# EAGLE design pc_rpi_healthypi_v3 (EAGLE 6.6.0)

## Sheet 1 of 2
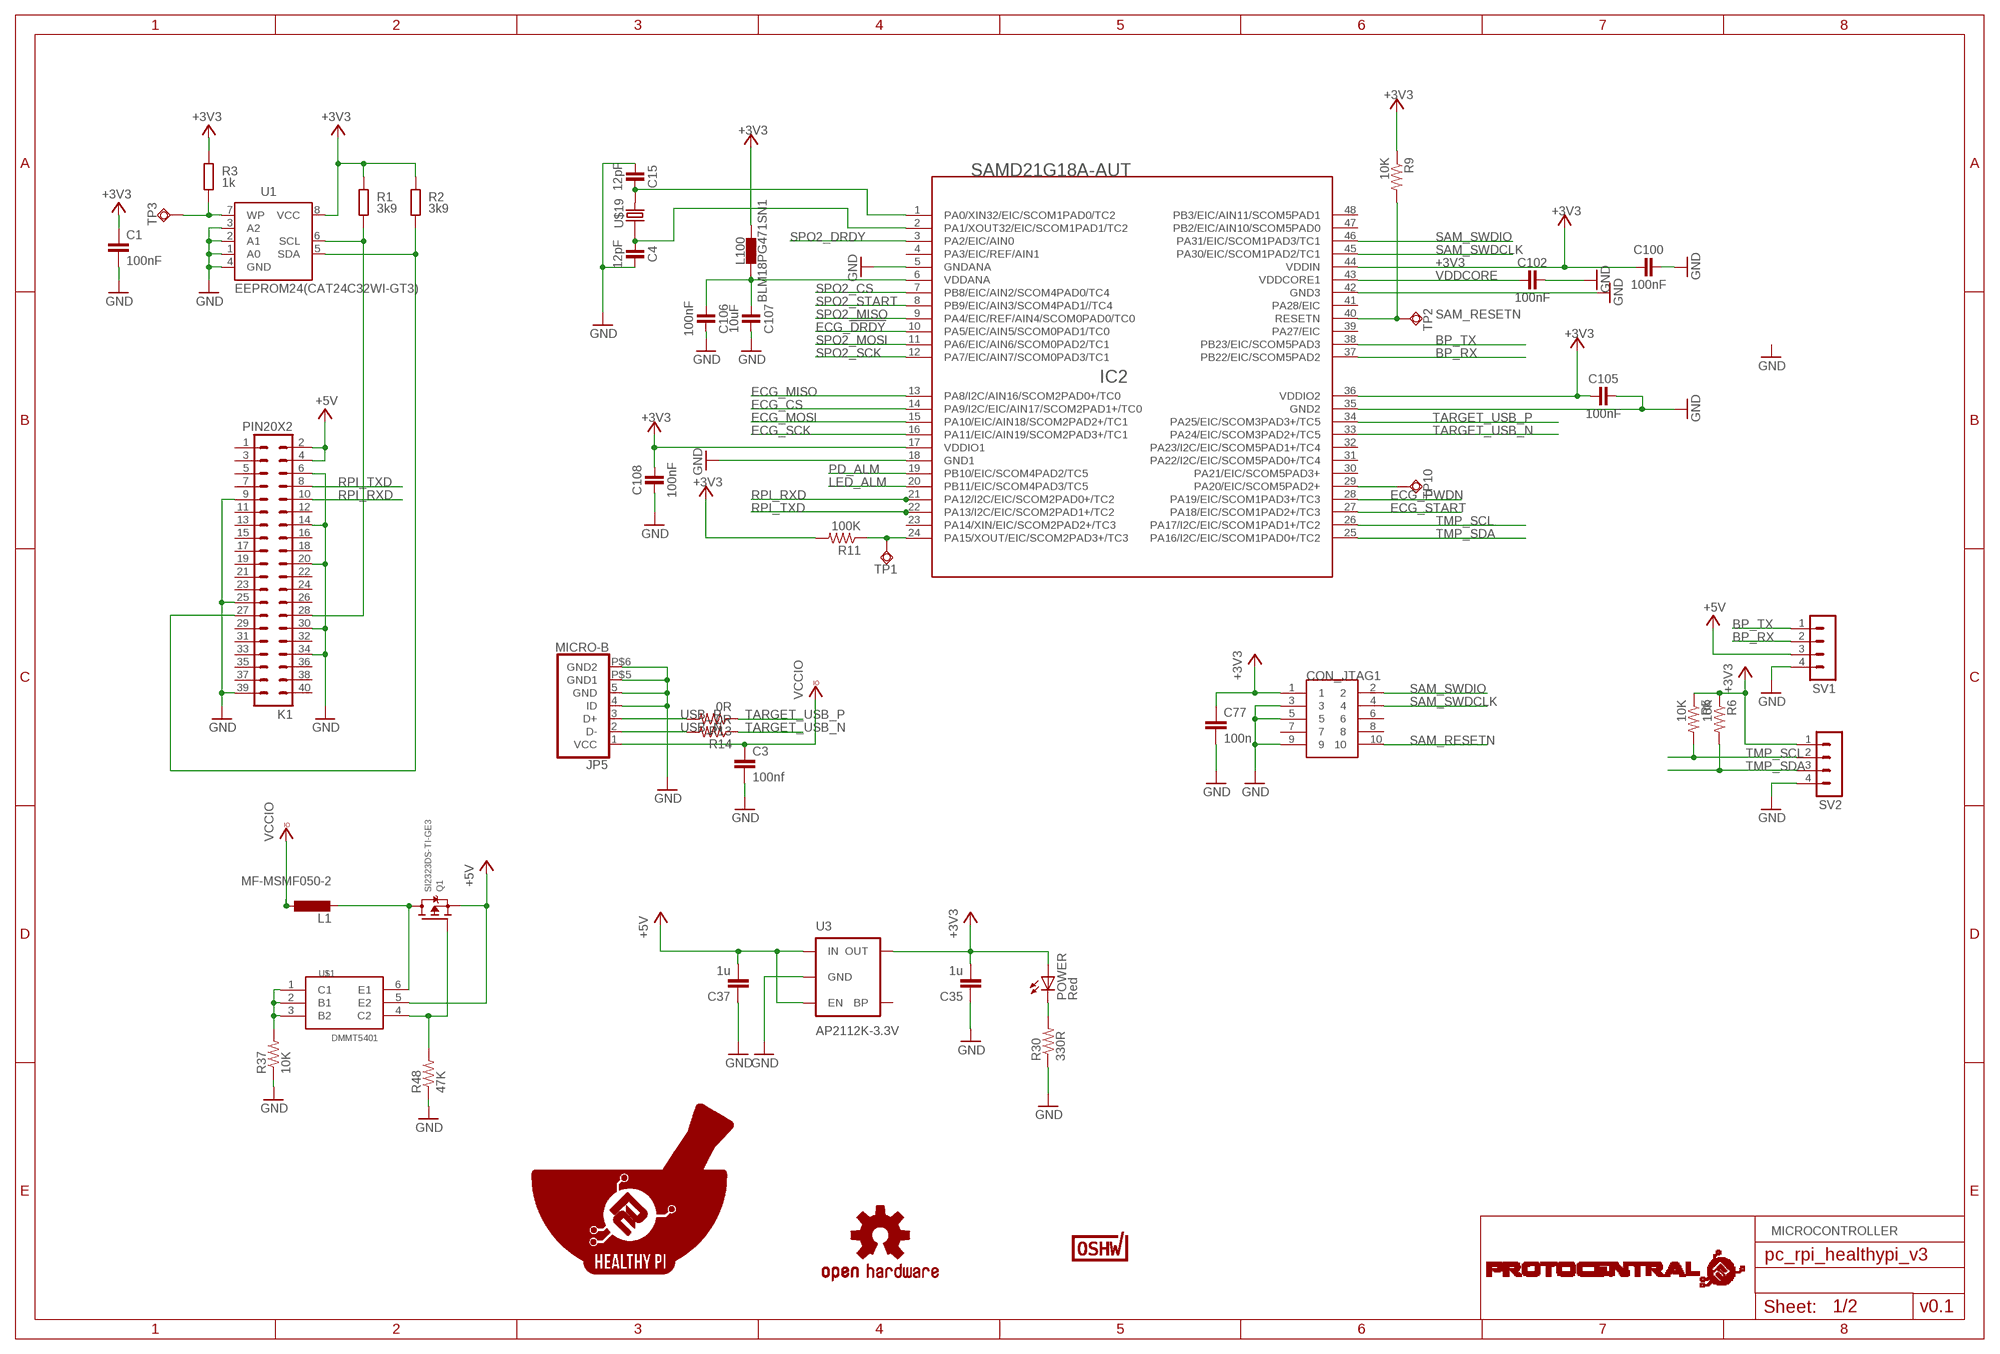
[diagram p0: schematic, sheet 1]

### Parts
C1  100nF  C-EUC0805K  [C0805K]
C3  100nf  C-EUC0402  [C0402]
C4  12pF  CAPACITORS-0402  [C0402]
C15  12pF  CAPACITORS-0402  [C0402]
C35  1u  C-EUC0402  [C0402]
C37  1u  C-EUC0402  [C0402]
C77  100n  C-EUC0805  [C0805]
C100  100nF  CAPACITORS-0805  [C0805]
C102  100nF  CAPACITORS-0805  [C0805]
C105  100nF  CAPACITORS-0805  [C0805]
C106  100nF  CAPACITORS-0805  [C0805]
C107  10uF  CAPACITORS-0805  [C0805]
C108  100nF  CAPACITORS-0805  [C0805]
CON_JTAG1  HDR-SMT-50MIL/5X2(20021121-00010C4LF)  HDR-SMT-50MIL/5X2  [HDR-SMT-50MIL/5X2]
IC2  SAMD21G18A-AUT  SAMD21G18A  [TQFP48]
JP5  MICRO-B  [MICRO-B]
K1  PIN20X2  [PIN_20X2]
L1  MF-MSMF050-2  L-EUL1812  [L1812]
L100  BLM18PG471SN1  INDUCTOR-0603  [C0603]
POWER  Red  LEDCHIPLED_0603  [CHIPLED_0603]
Q1  SI2323DS-TI-GE3  MOSFET-P  [SOT23-R]
R1  3k9  R-EU_M0805  [M0805]
R2  3k9  R-EU_M0805  [M0805]
R3  1k  R-EU_M0805  [M0805]
R5  10K  R-US_R0402  [R0402]
R6  10K  R-US_R0402  [R0402]
R9  10K  R-US_R0805  [R0805]
R11  100K  R-US_R0805  [R0805]
R13  0R  R-US_R0402  [R0402]
R14  0R  R-US_R0402  [R0402]
R30  330R  R-US_R0402  [R0402]
R37  10K  R-US_R0805  [R0805]
R48  47K  R-US_R0805  [R0805]
SV1  MA04-1  [MA04-1]
SV2  MA04-1  [MA04-1]
TP1  TPSQB1,27  [B1,27]
TP2  TPSQB1,27  [B1,27]
TP3  TPSQB1,27  [B1,27]
TP10  TPSQB1,27  [B1,27]
U1  EEPROM24(CAT24C32WI-GT3)  EEPROM24  [SOIC8]
U3  AP2112K-3.3V  V_REG_LDOSMD  [SOT23-5]
U$1  DMMT5401  [SOT26]
U$5  OSHW-LOGOM  [OSHW-LOGO-M]
U$6  PROTY_LOGO_WITH_TEXT  [PROTY_WITH_TEXT]
U$13  CERT-SMALL  [CERT-SMALL-SILK]
U$15  HEALTHYPI  [HEALTHYPI]
U$19  520-327-12.5-34B(32.768KHZ)  ECS-X-34B  [ECX-31B]

### Nets
+3V3: C1.1 C35.2 C77.1 C100.1 C105.1 C108.2 CON_JTAG1.1 IC2.17(VDDIO1) IC2.36(VDDIO2) IC2.44(VDDIN) L100.2 POWER.A R1.2 R2.2 R3.2 R5.1 R6.1 R9.1 R11.2 SV2.1 U1.8(VCC) U3.5(OUT) ; also sheet 2
+5V: C37.2 K1.2 K1.4 Q1.2(S) SV1.3 U3.1(IN) U3.3(EN) U$1.5(E2)
BP_RX: IC2.37(PB22/EIC/SCOM5PAD2) SV1.2
BP_TX: IC2.38(PB23/EIC/SCOM5PAD3) SV1.1
ECG_!DRDY: IC2.10(PA5/EIC/AIN5/SCOM0PAD1/TC0) ; also sheet 2
ECG_CS: IC2.14(PA9/I2C/EIC/AIN17/SCOM2PAD1+/TC0) ; also sheet 2
ECG_MISO: IC2.13(PA8/I2C/AIN16/SCOM2PAD0+/TC0) ; also sheet 2
ECG_MOSI: IC2.15(PA10/EIC/AIN18/SCOM2PAD2+/TC1) ; also sheet 2
ECG_PWDN: IC2.28(PA19/EIC/SCOM1PAD3+/TC3) ; also sheet 2
ECG_SCK: IC2.16(PA11/EIC/AIN19/SCOM2PAD3+/TC1) ; also sheet 2
ECG_START: IC2.27(PA18/EIC/SCOM1PAD2+/TC3) ; also sheet 2
GND: C1.2 C3.2 C4.2 C15.1 C35.1 C37.1 C77.2 C100.2 C102.2 C105.2 C106.2 C107.2 C108.1 CON_JTAG1.3 CON_JTAG1.5 CON_JTAG1.9 IC2.5(GNDANA) IC2.18(GND1) IC2.35(GND2) IC2.42(GND3) JP5.4(ID) JP5.5(GND) JP5.P$5(GND1) JP5.P$6(GND2) K1.6 K1.9 K1.14 K1.20 K1.25 K1.30 K1.34 K1.39 R30.1 R37.1 R48.1 SV1.4 SV2.4 U1.1(A0) U1.2(A1) U1.3(A2) U1.4(GND) U3.2(GND) ; also sheet 2
LED_ALM: IC2.20(PB11/EIC/SCOM4PAD3/TC5) ; also sheet 2
N$1: K1.28 R1.1 U1.6(SCL)
N$2: K1.27 R2.1 U1.5(SDA)
N$3: R3.1 TP3.TP U1.7(WP)
N$4: C15.2 IC2.1(PA0/XIN32/EIC/SCOM1PAD0/TC2) U$19.P$2
N$6: C106.1 C107.1 IC2.6(VDDANA) L100.1
N$7: POWER.C R30.2
N$25: C4.1 IC2.2(PA1/XOUT32/EIC/SCOM1PAD1/TC2) U$19.P$1
N$57: IC2.24(PA15/XOUT/EIC/SCOM2PAD3+/TC3) R11.1 TP1.TP
N$69: IC2.29(PA20/EIC/SCOM5PAD2+) TP10.TP
N$72: R37.2 U$1.1(C1) U$1.2(B1) U$1.3(B2)
N$73: Q1.1(G) R48.2 U$1.4(C2)
N$80: L1.2 Q1.3(D) U$1.6(E1)
PD_ALM: IC2.19(PB10/EIC/SCOM4PAD2/TC5) ; also sheet 2
RPI_RXD: IC2.21(PA12/I2C/EIC/SCOM2PAD0+/TC2) K1.10
RPI_TXD: IC2.22(PA13/I2C/EIC/SCOM2PAD1+/TC2) K1.8
SAM_RESETN: CON_JTAG1.10 IC2.40(RESETN) R9.2 TP2.TP
SAM_SWDCLK: CON_JTAG1.4 IC2.45(PA30/EIC/SCOM1PAD2/TC1)
SAM_SWDIO: CON_JTAG1.2 IC2.46(PA31/EIC/SCOM1PAD3/TC1)
SPO2_CS: IC2.7(PB8/EIC/AIN2/SCOM4PAD0/TC4) ; also sheet 2
SPO2_DRDY: IC2.3(PA2/EIC/AIN0) ; also sheet 2
SPO2_MISO: IC2.9(PA4/EIC/REF/AIN4/SCOM0PAD0/TC0) ; also sheet 2
SPO2_MOSI: IC2.11(PA6/EIC/AIN6/SCOM0PAD2/TC1) ; also sheet 2
SPO2_SCK: IC2.12(PA7/EIC/AIN7/SCOM0PAD3/TC1) ; also sheet 2
SPO2_START: IC2.8(PB9/EIC/AIN3/SCOM4PAD1//TC4) ; also sheet 2
TARGET_USB_N [USBpair]: IC2.33(PA24/EIC/SCOM3PAD2+/TC5) R14.1
TARGET_USB_P [USBpair]: IC2.34(PA25/EIC/SCOM3PAD3+/TC5) R13.1
TMP_SCL: IC2.26(PA17/I2C/EIC/SCOM1PAD1+/TC2) R5.2 SV2.2
TMP_SDA: IC2.25(PA16/I2C/EIC/SCOM1PAD0+/TC2) R6.2 SV2.3
USB_N [USBpair]: JP5.2(D-) R14.2
USB_P [USBpair]: JP5.3(D+) R13.2
VCCIO: C3.1 JP5.1(VCC) L1.1
VDDCORE: C102.1 IC2.43(VDDCORE1)
Unconnected: CON_JTAG1.6 CON_JTAG1.7 CON_JTAG1.8 IC2.4(PA3/EIC/REF/AIN1) IC2.23(PA14/XIN/EIC/SCOM2PAD2+/TC3) IC2.30(PA21/EIC/SCOM5PAD3+) IC2.31(PA22/I2C/EIC/SCOM5PAD0+/TC4) IC2.32(PA23/I2C/EIC/SCOM5PAD1+/TC4) IC2.39(PA27/EIC) IC2.41(PA28/EIC) IC2.47(PB2/EIC/AIN10/SCOM5PAD0) IC2.48(PB3/EIC/AIN11/SCOM5PAD1) K1.1 K1.3 K1.5 K1.7 K1.11 K1.12 K1.13 K1.15 K1.16 K1.17 K1.18 K1.19 K1.21 K1.22 K1.23 K1.24 K1.26 K1.29 K1.31 K1.32 K1.33 K1.35 K1.36 K1.37 K1.38 K1.40 U3.4(BP)

### Notes on the sheet
- MICROCONTROLLER
- v0.1

## Sheet 2 of 2
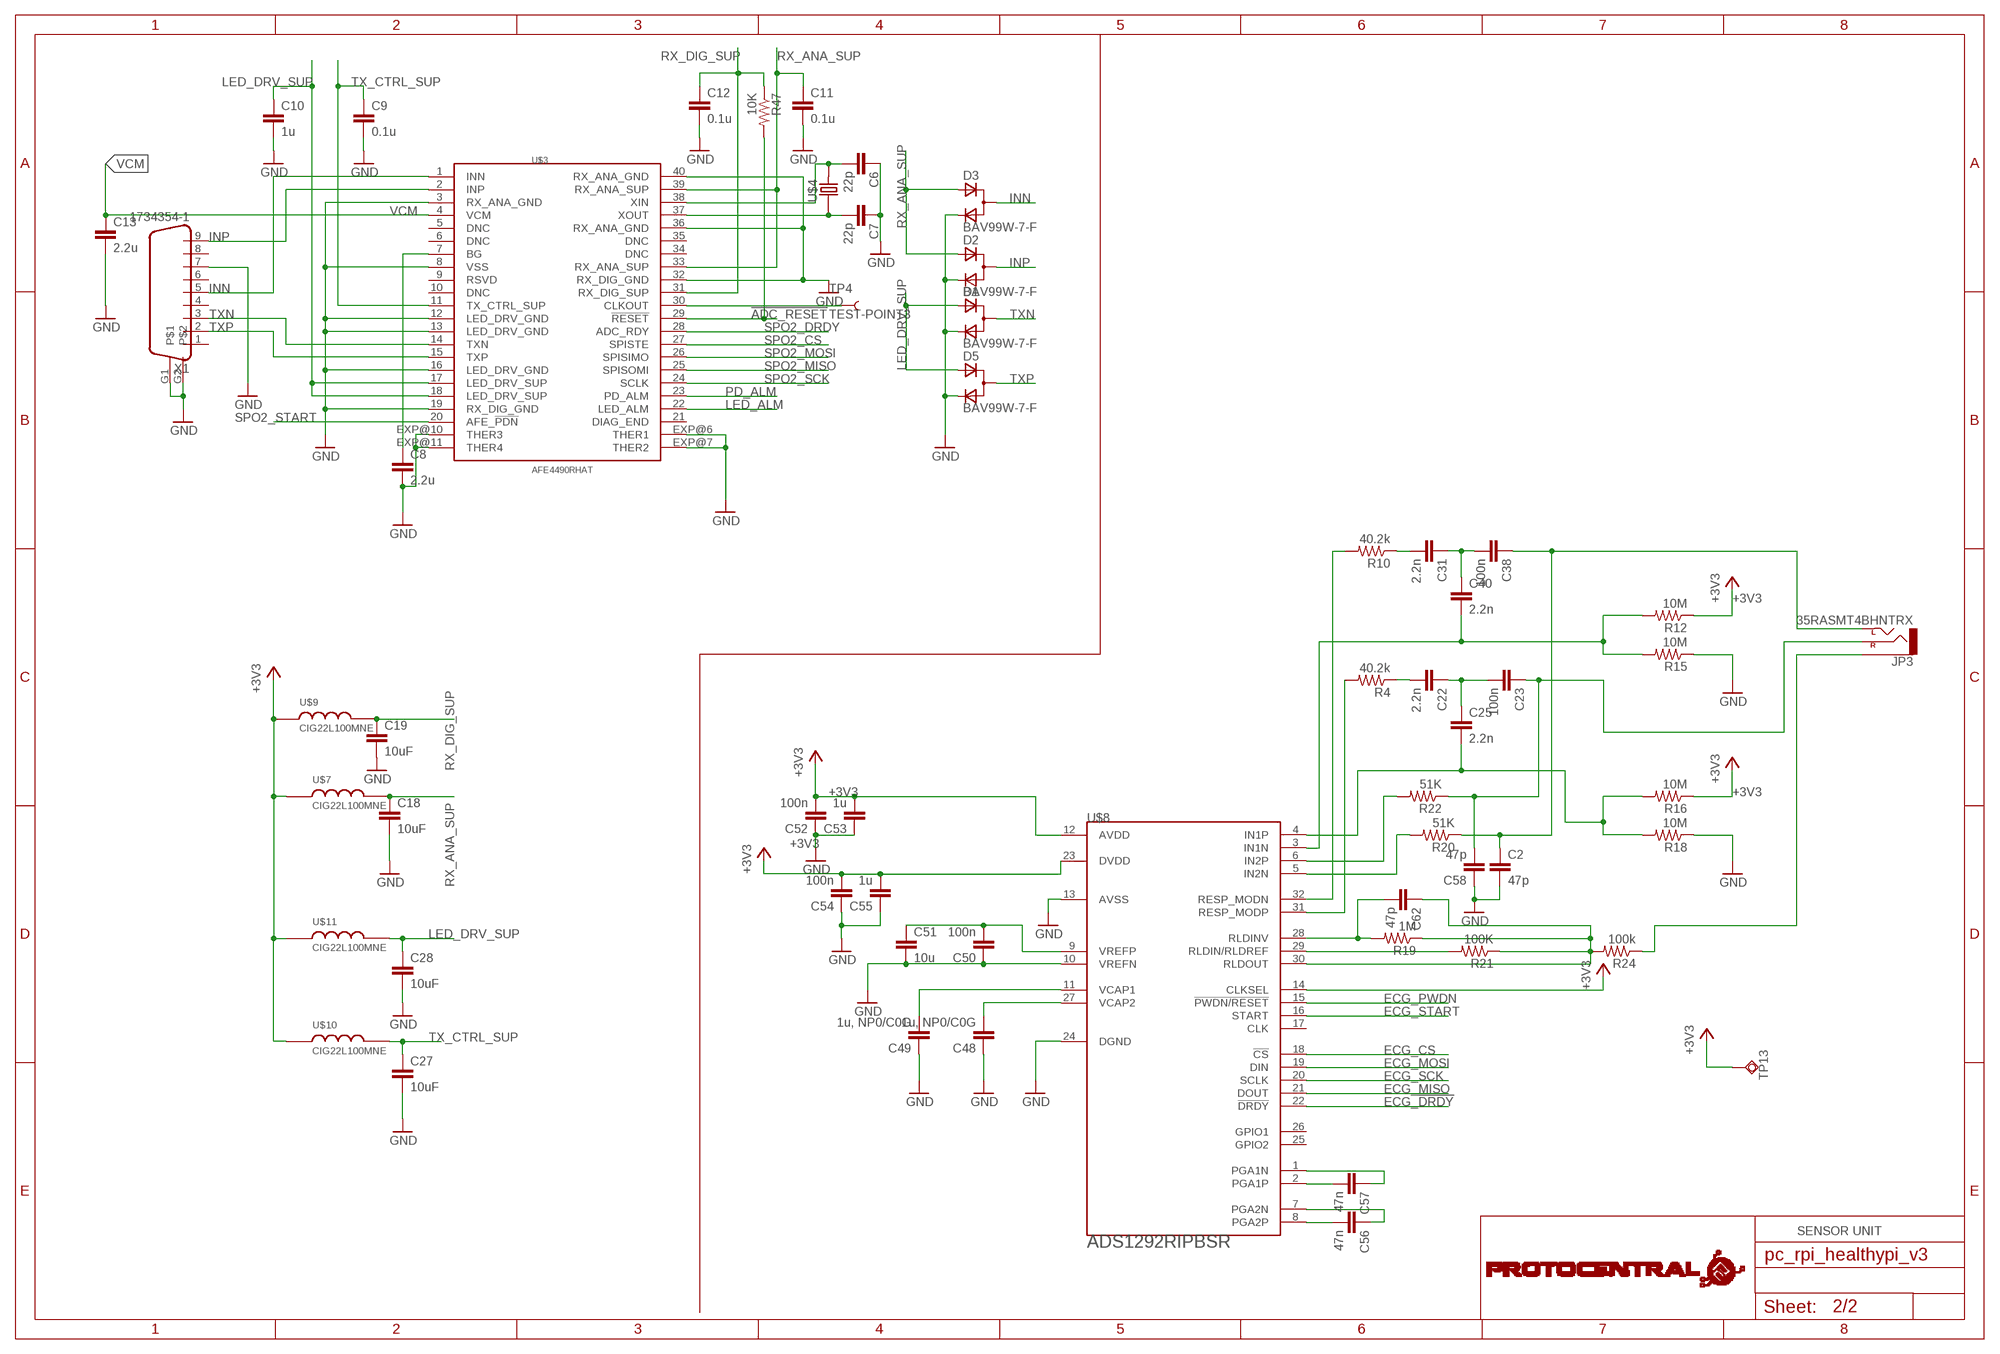
[diagram p1: schematic, sheet 2]

### Parts
C2  47p  C-EUC0402  [C0402]
C6  22p  C-EUC0402  [C0402]
C7  22p  C-EUC0402  [C0402]
C8  2.2u  C-EUC0402  [C0402]
C9  0.1u  C-EUC0402  [C0402]
C10  1u  C-EUC0805  [C0805]
C11  0.1u  C-EUC0402  [C0402]
C12  0.1u  C-EUC0402  [C0402]
C13  2.2u  C-EUC0402  [C0402]
C18  10uF  C-EUC0805  [C0805]
C19  10uF  C-EUC0805  [C0805]
C22  2.2n  C-EUC0402  [C0402]
C23  100n  C-EUC0402  [C0402]
C25  2.2n  C-EUC0402  [C0402]
C27  10uF  C-EUC0805  [C0805]
C28  10uF  C-EUC0805  [C0805]
C31  2.2n  C-EUC0402  [C0402]
C38  100n  C-EUC0402  [C0402]
C40  2.2n  C-EUC0402  [C0402]
C48  1u, NP0/C0G  C-EUC0402  [C0402]
C49  1u, NP0/C0G  C-EUC0402  [C0402]
C50  100n  C-EUC0402  [C0402]
C51  10u  C-EUC0603  [C0603]
C52  100n  C-EUC0402  [C0402]
C53  1u  C-EUC0402  [C0402]
C54  100n  C-EUC0402  [C0402]
C55  1u  C-EUC0402  [C0402]
C56  47n  C-EUC0402  [C0402]
C57  47n  C-EUC0402  [C0402]
C58  47p  C-EUC0402  [C0402]
C62  47p  C-EUC0402  [C0402]
D1  BAV99W-7-F  D_ACACSOT323  [SOT323]
D2  BAV99W-7-F  D_ACACSOT323  [SOT323]
D3  BAV99W-7-F  D_ACACSOT323  [SOT323]
D5  BAV99W-7-F  D_ACACSOT323  [SOT323]
JP3  35RASMT4BHNTRX  AUDIO-JACKSMD2  [AUDIO-JACK-3.5MM-SMD]
R4  40.2k  R-US_R0402  [R0402]
R10  40.2k  R-US_R0402  [R0402]
R12  10M  R-US_R0402  [R0402]
R15  10M  R-US_R0402  [R0402]
R16  10M  R-US_R0402  [R0402]
R18  10M  R-US_R0402  [R0402]
R19  1M  R-US_R0402  [R0402]
R20  51K  R-US_R0402  [R0402]
R21  100K  R-US_R0402  [R0402]
R22  51K  R-US_R0402  [R0402]
R24  100k  R-US_R0402  [R0402]
R47  10K  R-US_R0402  [R0402]
TP4  TEST-POINT3  [PAD.03X.03]
TP13  TPSQB1,27  [B1,27]
U$2  PROTY_LOGO_WITH_TEXT  [PROTY_WITH_TEXT]
U$3  AFE4490RHAT  AFE4400  [QFN-40]
U$4  ABM3  [ABM3]
U$7  CIG22L100MNE  LPS  [LPS]
U$8  ADS1292RIPBSR  ADS1292R-TQFP  [SQFP-S-5X5-32]
U$9  CIG22L100MNE  LPS  [LPS]
U$10  CIG22L100MNE  LPS  [LPS]
U$11  CIG22L100MNE  LPS  [LPS]
X1  1734354-1  DB9_STRIGHT  [DB9-STRIGHT]

### Nets
!ADC_RESET: R47.2 U$3.29(!RESET)
+3V3: C52.2 C53.2 C54.2 C55.2 R12.1 R16.1 TP13.TP U$7.1 U$8.12(AVDD) U$8.14(CLKSEL) U$8.23(DVDD) U$9.1 U$10.1 U$11.1 ; also sheet 1
ECG_!DRDY: U$8.22(!DRDY) ; also sheet 1
ECG_CS: U$8.18(!CS) ; also sheet 1
ECG_MISO: U$8.21(DOUT) ; also sheet 1
ECG_MOSI: U$8.19(DIN) ; also sheet 1
ECG_PWDN: U$8.15(!PWDN/RESET) ; also sheet 1
ECG_SCK: U$8.20(SCLK) ; also sheet 1
ECG_START: U$8.16(START) ; also sheet 1
GND: C2.2 C6.1 C7.1 C8.2 C9.2 C10.2 C11.2 C12.2 C13.2 C18.2 C19.2 C27.2 C28.2 C48.1 C49.1 C50.1 C51.2 C52.1 C53.1 C54.1 C55.1 C58.1 D1.2(C) D2.2(C) D3.2(C) D5.2(C) R15.1 R18.1 U$3.3(RX_ANA_GND) U$3.8(VSS) U$3.12(LED_DRV_GND) U$3.13(LED_DRV_GND) U$3.16(LED_DRV_GND) U$3.19(RX_DIG_GND) U$3.32(RX_DIG_GND) U$3.36(RX_ANA_GND) U$3.40(RX_ANA_GND) U$3.EXP@6(THER1) U$3.EXP@7(THER2) U$3.EXP@10(THER3) U$3.EXP@11(THER4) U$8.10(VREFN) U$8.13(AVSS) U$8.24(DGND) X1.7 X1.G1 X1.G2 ; also sheet 1
INN: D3.1(CA) U$3.1(INN) X1.5
INP: D2.1(CA) U$3.2(INP) X1.9
LED_ALM: U$3.22(LED_ALM) ; also sheet 1
LED_DRV_SUP: C10.1 C28.1 D1.3(A) D5.3(A) U$3.17(LED_DRV_SUP) U$3.18(LED_DRV_SUP) U$11.2
N$8: R4.2 U$8.31(RESP_MODP)
N$9: C6.2 U$3.38(XIN) U$4.2
N$10: C22.2 R4.1
N$11: C22.1 C23.2 C25.1
N$12: R22.2 U$8.6(IN2P)
N$13: C7.2 U$3.37(XOUT) U$4.1
N$14: R20.2 U$8.5(IN2N)
N$15: C8.1 U$3.7(BG)
N$16: TP4.P$1 U$3.30(CLKOUT)
N$19: C48.2 U$8.27(VCAP2)
N$26: R10.2 U$8.32(RESP_MODN)
N$28: C31.2 R10.1
N$29: C31.1 C38.2 C40.1
N$30: C2.1 C38.1 JP3.TIP(LEFT) R20.1
N$31: C40.2 R12.2 R15.2 U$8.3(IN1N)
N$32: C25.2 R16.2 R18.2 U$8.4(IN1P)
N$33: R21.2 U$8.29(RLDIN/RLDREF)
N$34: C62.2 R19.2 U$8.28(RLDINV)
N$36: C49.2 U$8.11(VCAP1)
N$37: C56.2 U$8.8(PGA2P)
N$38: C56.1 U$8.7(PGA2N)
N$40: C50.2 C51.1 U$8.9(VREFP)
N$41: C57.2 U$8.2(PGA1P)
N$43: C57.1 U$8.1(PGA1N)
N$45: C23.1 C58.2 JP3.RING(RIGHT) R22.1
N$50: C62.1 R19.1 R21.1 R24.2 U$8.30(RLDOUT)
N$51: JP3.SLEEVE R24.1
PD_ALM: U$3.23(PD_ALM) ; also sheet 1
RX_ANA_SUP: C11.1 C18.1 D2.3(A) D3.3(A) U$3.33(RX_ANA_SUP) U$3.39(RX_ANA_SUP) U$7.2
RX_DIG_SUP: C12.1 C19.1 R47.1 U$3.31(RX_DIG_SUP) U$9.2
SPO2_CS: U$3.27(SPISTE) ; also sheet 1
SPO2_DRDY: U$3.28(ADC_RDY) ; also sheet 1
SPO2_MISO: U$3.25(SPISOMI) ; also sheet 1
SPO2_MOSI: U$3.26(SPISIMO) ; also sheet 1
SPO2_SCK: U$3.24(SCLK) ; also sheet 1
SPO2_START: U$3.20(AFE_!PDN) ; also sheet 1
TX_CTRL_SUP: C9.1 C27.1 U$3.11(TX_CTRL_SUP) U$10.2
TXN: D1.1(CA) U$3.14(TXN) X1.3
TXP: D5.1(CA) U$3.15(TXP) X1.2
VCM: C13.1 U$3.4(VCM)
Unconnected: U$3.5(DNC) U$3.6(DNC) U$3.9(RSVD) U$3.10(DNC) U$3.21(DIAG_END) U$3.34(DNC) U$3.35(DNC) U$8.17(CLK) U$8.25(GPIO2) U$8.26(GPIO1) X1.1 X1.4 X1.6 X1.8

### Notes on the sheet
- SENSOR UNIT

## Library data of the parts
C1 = resistor:C-EU: CAPACITOR, European symbol; DIELECTRIC: X7R
C2 C3 C6-C13 C18 C19 C22 C23 C25 C27 C28 C31 C35 C37 C38 C40 C48-C50 C52-C58 C62 C77 = rcl:C-EU: CAPACITOR, European symbol
C4 C15 C100 C102 C105-C108 = Arduino:CAPACITORS: Capacitors ...4.7uF @ 6.3V -> 0402 ...10uF @ 16V -> 0603 ...22uF @ 25V -> 0805
C51 = resistor:C-EU: CAPACITOR, European symbol
CON_JTAG1 = circuitects:HDR-SMT-50MIL/5X2
D1-D3 D5 = zetex:D_ACAC: Dual DIODE; OC_FARNELL: unknown; OC_NEWARK: unknown
IC2 = Arduino:SAMD21G18A: Atmel D21 32bit ARM Cortex-M0 microcontroller - 48 PIN TQFP 256KB flash memory + 32KB SRAM
JP3 = SparkFun-Connectors:AUDIO-JACK: 3.5mm Audio Jack Simple 3.5mm common PCB mount audio jack. SKU: PRT-08032; PROD_ID: CONN-10353
JP5 = circuitects:MICRO-B
K1 = FLYFISH:PIN20X2
L1 = rcl:L-EU: INDUCTOR, European symbol
L100 = Arduino:INDUCTOR: Inductors
POWER = led:LED: LED OSRAM: - CHIPLED LG R971, LG N971, LY N971, LG Q971, LY Q971, LO R971, LY R971 LH N974, LH R974 LS Q976, LO Q976, LY Q976 LO Q996 - Hyper CHIPLED LW Q18S LB Q993, LB Q99A, LB R99A - SideLED LS A670, LO A670, LY A670, LG A670, LP A670 LB A673, LV A673, LT A673, LW A673 LH A674 LY A675 LS A676, LA A676, LO A676, LY A676, LW A676 LS A679, LY A679, LG A679 - Hyper Micro SIDELED® LS Y876, LA Y876, LO Y876, LY Y876 LT Y87S - SmartLED LW L88C, LW L88S LB L89C, LB L89S, LG L890 LS L89K, LO L89K, LY L89K LS L896, LA L896, LO L896, LY L896 - TOPLED LS T670, LO T670, LY T670, LG T670, LP T670 LSG T670, LSP T670, LSY T670, LOP T670, LYG T670 LG T671, LOG T671, LSG T671 LB T673, LV T673, LT T673, LW T673 LH T674 LS T676, LA T676, LO T676, LY T676, LB T676, LH T676, LSB T676, LW T676 LB T67C, LV T67C, LT T67C, LS T67K, LO T67K, LY T67K, LW E67C LS E67B, LA E67B, LO E67B, LY E67B, LB E67C, LV E67C, LT E67C LW T67C LS T679, LY T679, LG T679 LS T770, LO T770, LY T770, LG T770, LP T770 LB T773, LV T773, LT T773, LW T773 LH T774 LS E675, LA E675, LY E675, LS T675 LS T776, LA T776, LO T776, LY T776, LB T776 LHGB T686 LT T68C, LB T68C - Hyper Mini TOPLED® LB M676 - Mini TOPLED Santana® LG M470 LS M47K, LO M47K, LY M47K Source: http://www.osram.convergy.de LUXEON: - LUMILED® LXK2-PW12-R00, LXK2-PW12-S00, LXK2-PW14-U00, LXK2-PW14-V00 LXK2-PM12-R00, LXK2-PM12-S00, LXK2-PM14-U00 LXK2-PE12-Q00, LXK2-PE12-R00, LXK2-PE12-S00, LXK2-PE14-T00, LXK2-PE14-U00 LXK2-PB12-K00, LXK2-PB12-L00, LXK2-PB12-M00, LXK2-PB14-N00, LXK2-PB14-P00, LXK2-PB14-Q00 LXK2-PR12-L00, LXK2-PR12-M00, LXK2-PR14-Q00, LXK2-PR14-R00 LXK2-PD12-Q00, LXK2-PD12-R00, LXK2-PD12-S00 LXK2-PH12-R00, LXK2-PH12-S00 LXK2-PL12-P00, LXK2-PL12-Q00, LXK2-PL12-R00 Source: www.luxeon.com KINGBRIGHT: KA-3528ASYC Source: www.kingbright.com
Q1 = microbuilder:MOSFET-P: P-Channel Mosfet SOT-23 IRLML5103 30V 760mA 1V Vgs - Digikey: IRLML5103PBFCT-ND NTR0202PL 20V 400mA 2.3V Vgs - Digikey: NTR0202PLT1GOSTR-ND NTR4101PT1G 20V 1.8A 1.2V Vgs - Digikey: NTR4101PT1GOSCT-ND DMP2004K 20V 600mA 1V Vgs - Digikey: DMP2004KDICT-ND
R1-R3 = resistor:R-EU_: RESISTOR, European symbol; TOLERANCE: 5%
R4-R6 R9-R16 R18-R22 R24 R30 R37 R47 R48 = rcl:R-US_: RESISTOR, American symbol
SV1 SV2 = con-lstb:MA04-1: PIN HEADER; OC_FARNELL: unknown; OC_NEWARK: unknown
TP1-TP3 TP10 TP13 = testpad:TPSQ: Test pad
TP4 = SparkFun:TEST-POINT
U1 = FLYFISH:EEPROM24
U3 = SparkFun-PowerIC:V_REG_LDO: Voltage Regulator LDO Standard 150mA LDO voltage regulator in SOT-23 layout. Micrel part MIC5205. BP (by-pass) pin is used to lower output noise with 470pF cap.; PROD_ID: VREG-12457
U$1 = circuitects:DMMT5401
U$2 U$6 = circuitects:PROTY_LOGO_WITH_TEXT
U$3 = circuitects:AFE4400
U$4 = circuitects:ABM3
U$5 = SparkFun:OSHW-LOGO: Open Source Hardware Logo This logo indicates the piece of hardware it is found on incorporates a OSHW license and/or adheres to the definition of open source hardware found here: http://freedomdefined.org/OSHW
U$7 U$9-U$11 = circuitects:LPS
U$8 = circuitects:ADS1292R-TQFP
U$13 = OSHWA:CERT
U$15 = circuitects:HEALTHYPI
U$19 = circuitects:ECS-X-34B
X1 = circuitects:DB9_STRIGHT

## Net classes
2 gnd: width 0.102 mm, drill 0.1 mm
4 USBpair: width 0.102 mm, drill 0.1 mm, clearance 0.15 mm to class 3

## Board
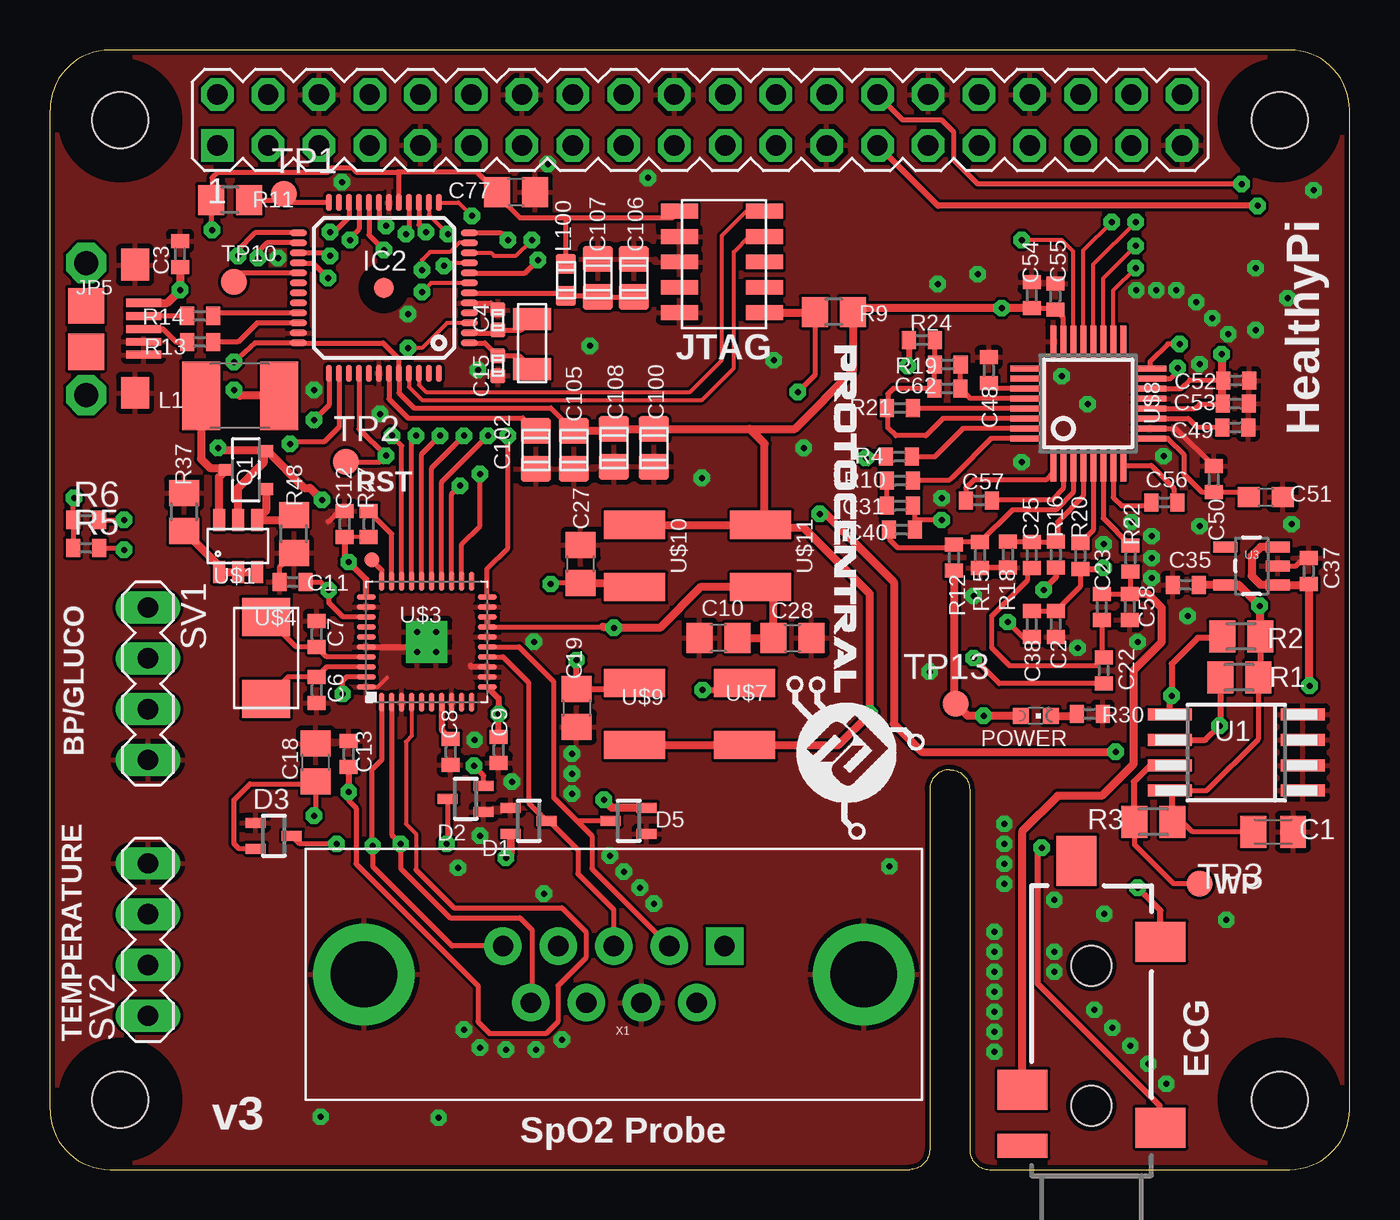
[diagram p2: board, top side]
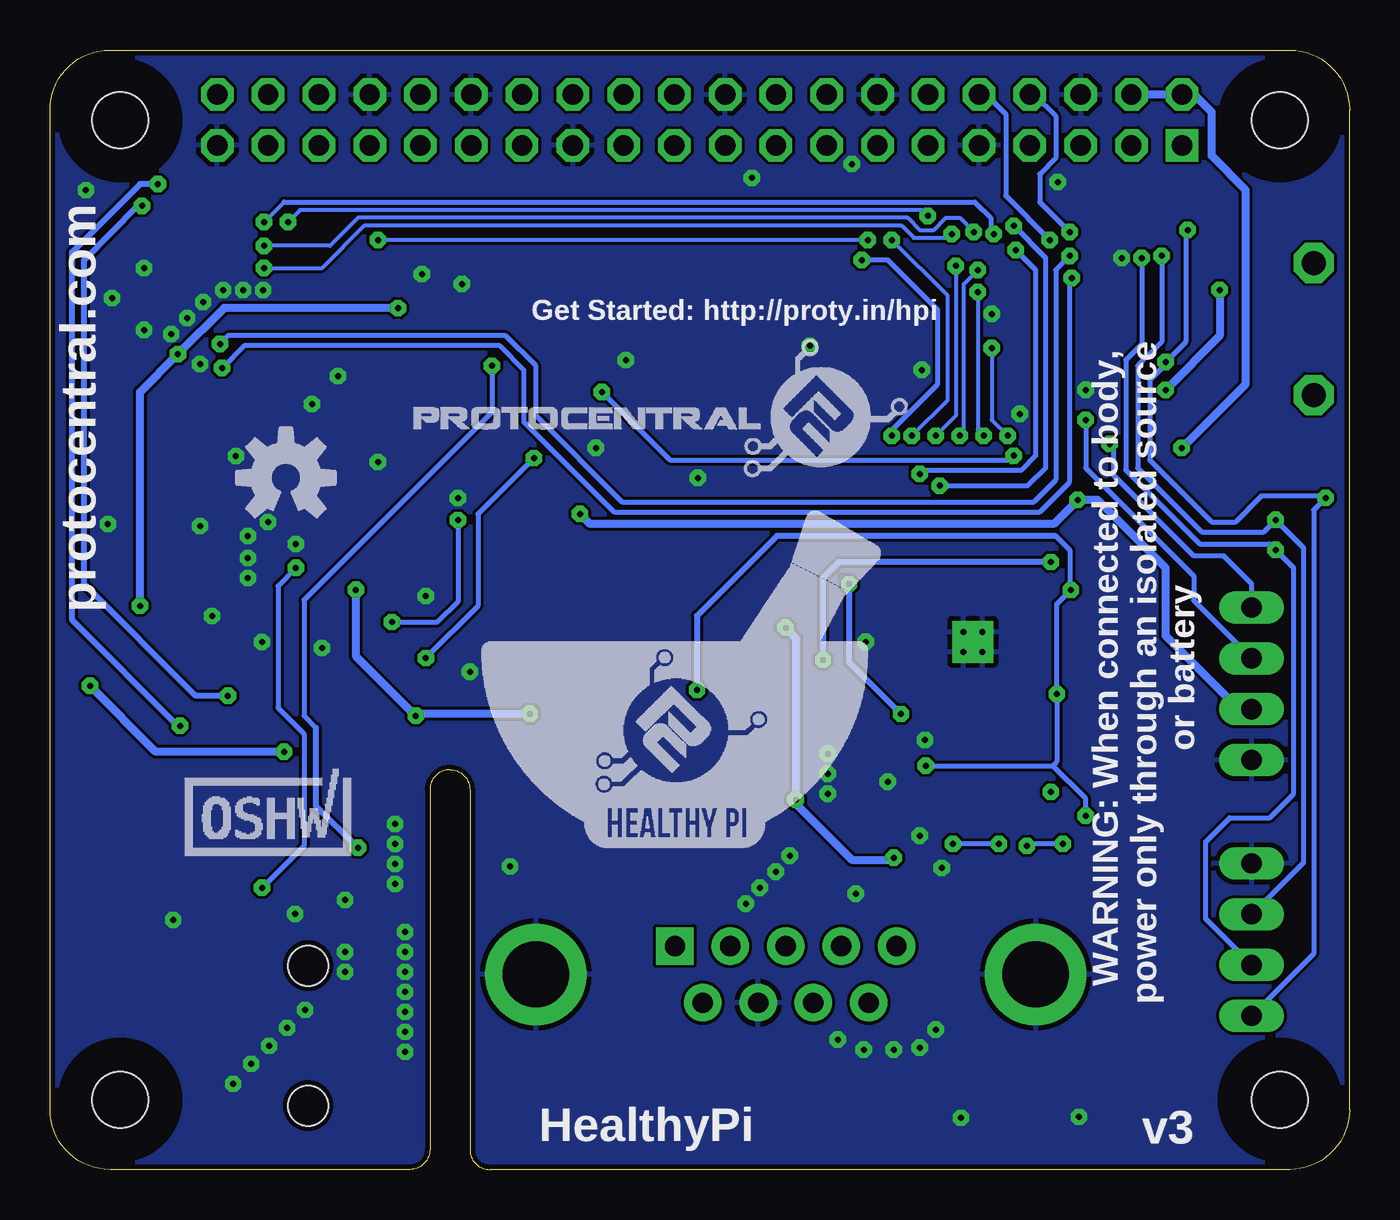
[diagram p3: board, bottom side, seen from below]

Size 65 x 56 mm. Coordinates in mm from the lower left corner, seen from the top.
Outline: 0,3 arc90 3,0 43,0 arc90 44,1 44,19 arc-90 45,20 arc-90 46,19 46,1 arc90 47,0 62,0 arc90 65,3 65,53 arc90 62,56 3,56 arc90 0,53 0,3
Copper layers (1*2*15*16): Top 0.035mm / dielectric 1.5mm / Route2 0.035mm / dielectric 0.15mm / Route15 0.035mm / dielectric 0.2mm / Bottom 0.035mm
Design rules "Circuitects-Rules": minimum track width 6mil, minimum drill 0.3mm, track to track 6mil, track to pad 6mil, pad to pad 6mil, via to via 6mil, smd to smd 6mil, copper to edge 10mil, drill to drill 8mil, minimum pad ring 12mil, minimum via ring 10mil, stop-mask expansion 4mil, vias tented up to drill 25mil, thermal gap 10mil
Holes 2.8 mm at 3.5,3.5 3.5,52.5 61.5,52.5 61.5,3.5
tRestrict: area 1.9,51 to 5,54; area 60,51 to 63,54; area 60,1.9 to 63,5; area 1.9,1.9 to 5,5
bRestrict: area 1.9,1.9 to 5,5; area 1.9,51 to 5,54; area 60,1.9 to 63,5; area 60,51 to 63,54

### Footprints (pad centres in the part's own frame; a part is rotated, then mirrored left to right if it is on the bottom)
C0805K = smd 1.3 x 1.6: 1 -1,0; 2 1,0
C0402 = smd 0.7 x 0.9: 1 -0.65,0; 2 0.65,0
C0402' = smd 0.75 x 0.7: 1 0,0.5; 2 0,-0.5
C0805 = smd 1.3 x 1.5: 1 -0.95,0; 2 0.95,0
C0603 = smd 1.1 x 1: 1 -0.85,0; 2 0.85,0
C0805' = smd 1.5 x 1.25: 1 0,0.95; 2 0,-0.95
HDR-SMT-50MIL/5X2 = smd 0.74 x 1.85: 1 -2.54,-2.125; 2 -2.54,2.125; 3 -1.27,-2.125; 4 -1.27,2.125; 5 0,-2.125; 6 0,2.125; 7 1.27,-2.125; 8 1.27,2.125; 9 2.54,-2.125; 10 2.54,2.125
SOT323 = smd 0.5 x 1: 1 0,0.9; 2 -0.65,-0.9; 3 0.65,-0.9
TQFP48 = smd 0.85 x 0.32: 1 -4.275,2.75; 2 -4.275,2.25; 3 -4.275,1.75; 4 -4.275,1.25; 5 -4.275,0.75; 6 -4.275,0.25; 7 -4.275,-0.25; 8 -4.275,-0.75; 9 -4.275,-1.25; 10 -4.275,-1.75; 11 -4.275,-2.25; 12 -4.275,-2.75; 25 4.275,-2.75; 26 4.275,-2.25; 27 4.275,-1.75; 28 4.275,-1.25; 29 4.275,-0.75; 30 4.275,-0.25; 31 4.275,0.25; 32 4.275,0.75; 33 4.275,1.25; 34 4.275,1.75; 35 4.275,2.25; 36 4.275,2.75 | smd 0.32 x 0.85: 13 -2.75,-4.275; 14 -2.25,-4.275; 15 -1.75,-4.275; 16 -1.25,-4.275; 17 -0.75,-4.275; 18 -0.25,-4.275; 19 0.25,-4.275; 20 0.75,-4.275; 21 1.25,-4.275; 22 1.75,-4.275; 23 2.25,-4.275; 24 2.75,-4.275; 37 2.75,4.275; 38 2.25,4.275; 39 1.75,4.275; 40 1.25,4.275; 41 0.75,4.275; 42 0.25,4.275; 43 -0.25,4.275; 44 -0.75,4.275; 45 -1.25,4.275; 46 -1.75,4.275; 47 -2.25,4.275; 48 -2.75,4.275 | smd 1 x 1: P$1 0,0
AUDIO-JACK-3.5MM-SMD = smd 2 x 2.5: RING 4.3,3.45; SLEEVE 2.4,-3.45; TIP 11.7,-3.45 | smd 1.2 x 2.5: RSH 1.5,3.45 | smd 2.5 x 2: TSH 15.75,0.75 | hole 2: 3.5,0; 10.5,0
MICRO-B = smd 0.4 x 1.75: 1 -1.25,2.975; 2 -0.6,2.975; 3 0.05,2.975; 4 0.7,2.975; 5 1.35,2.975 | smd 1.8 x 1.8: P$1 -1.1,0.1; P$2 1.2,0.1 | drill 1.2 pad 2 octagon: P$3 -3.25,0.1; P$4 3.35,0.1 | smd 1.6 x 1.4: P$5 -3.15,2.55; P$6 3.25,2.55
PIN_20X2 = drill 1.016 square: 1 -24.13,-1.27 | drill 1.016 octagon: 2 -24.13,1.27; 3 -21.59,-1.27; 4 -21.59,1.27; 5 -19.05,-1.27; 6 -19.05,1.27; 7 -16.51,-1.27; 8 -16.51,1.27; 9 -13.97,-1.27; 10 -13.97,1.27; 11 -11.43,-1.27; 12 -11.43,1.27; 13 -8.89,-1.27; 14 -8.89,1.27; 15 -6.35,-1.27; 16 -6.35,1.27; 17 -3.81,-1.27; 18 -3.81,1.27; 19 -1.27,-1.27; 20 -1.27,1.27; 21 1.27,-1.27; 22 1.27,1.27; 23 3.81,-1.27; 24 3.81,1.27; 25 6.35,-1.27; 26 6.35,1.27; 27 8.89,-1.27; 28 8.89,1.27; 29 11.43,-1.27; 30 11.43,1.27; 31 13.97,-1.27; 32 13.97,1.27; 33 16.51,-1.27; 34 16.51,1.27; 35 19.05,-1.27; 36 19.05,1.27; 37 21.59,-1.27; 38 21.59,1.27; 39 24.13,-1.27; 40 24.13,1.27
L1812 = smd 1.9 x 3.4: 1 -1.95,0; 2 1.95,0
C0603' = smd 1 x 0.95: 1 0,0.8; 2 0,-0.8
CHIPLED_0603 = smd 0.8 x 0.8: A 0,-0.75; C 0,0.75
SOT23-R = smd 0.6 x 0.7: 1 -0.95,-1; 2 0.95,-1; 3 0,1
M0805 = smd 1.3 x 1.6: 1 -0.95,0; 2 0.95,0
R0402 = smd 0.7 x 0.9: 1 -0.65,0; 2 0.65,0
R0805 = smd 1.3 x 1.5: 1 -0.95,0; 2 0.95,0
MA04-1 = drill 1.016 long: 1 -3.81,0; 2 -1.27,0; 3 1.27,0; 4 3.81,0
B1,27 = smd 1.27 x 1.27: TP 0,0
PAD.03X.03 = smd 0.762 x 0.762: P$1 0,0
SOIC8 = smd 0.6 x 2.2: 1 -1.905,-3.33; 2 -0.635,-3.33; 3 0.635,-3.33; 4 1.905,-3.33; 5 1.905,3.33; 6 0.635,3.33; 7 -0.635,3.33; 8 -1.905,3.33
SOT23-5 = smd 0.55 x 1.2: 1 -0.95,-1.3; 2 0,-1.3; 3 0.95,-1.3; 4 0.95,1.3; 5 -0.95,1.3
SOT26 = smd 0.6 x 1.1: 1 -0.95,-1.3; 2 0,-1.3; 3 0.95,-1.3; 4 0.95,1.3; 5 0,1.3; 6 -0.95,1.3
QFN-40 = smd 0.95 x 0.28: 1 -3.025,2.25; 2 -3.025,1.75; 3 -3.025,1.25; 4 -3.025,0.75; 5 -3.025,0.25; 6 -3.025,-0.25; 7 -3.025,-0.75; 8 -3.025,-1.25; 9 -3.025,-1.75; 10 -3.025,-2.25; 21 3.025,-2.25; 22 3.025,-1.75; 23 3.025,-1.25; 24 3.025,-0.75; 25 3.025,-0.25; 26 3.025,0.25; 27 3.025,0.75; 28 3.025,1.25; 29 3.025,1.75; 30 3.025,2.25 | smd 0.28 x 0.95: 11 -2.25,-3.025; 12 -1.75,-3.025; 13 -1.25,-3.025; 14 -0.75,-3.025; 15 -0.25,-3.025; 16 0.25,-3.025; 17 0.75,-3.025; 18 1.25,-3.025; 19 1.75,-3.025; 20 2.25,-3.025; 31 2.25,3.025; 32 1.75,3.025; 33 1.25,3.025; 34 0.75,3.025; 35 0.25,3.025; 36 -0.25,3.025; 37 -0.75,3.025; 38 -1.25,3.025; 39 -1.75,3.025; 40 -2.25,3.025 | drill 0.3 pad 1.1 square: EXP@6 -0.5,0.475; EXP@7 0.5,0.475; EXP@10 -0.5,-0.475; EXP@11 0.5,-0.475
ABM3 = smd 1.9 x 2.4: 1 -2.05,0; 2 2.05,0
LPS = smd 1.4 x 3.05: 1 -1.56,0; 2 1.56,0
SQFP-S-5X5-32 = smd 0.3 x 1.6: 1 -1.75,-3.1; 2 -1.25,-3.1; 3 -0.75,-3.1; 4 -0.25,-3.1; 5 0.25,-3.1; 6 0.75,-3.1; 7 1.25,-3.1; 8 1.75,-3.1; 17 1.75,3.1; 18 1.25,3.1; 19 0.75,3.1; 20 0.25,3.1; 21 -0.25,3.1; 22 -0.75,3.1; 23 -1.25,3.1; 24 -1.75,3.1 | smd 1.6 x 0.3: 9 3.1,-1.75; 10 3.1,-1.25; 11 3.1,-0.75; 12 3.1,-0.25; 13 3.1,0.25; 14 3.1,0.75; 15 3.1,1.25; 16 3.1,1.75; 25 -3.1,1.75; 26 -3.1,1.25; 27 -3.1,0.75; 28 -3.1,0.25; 29 -3.1,-0.25; 30 -3.1,-0.75; 31 -3.1,-1.25; 32 -3.1,-1.75
ECX-31B = smd 1.1 x 1.9: P$1 1.25,0; P$2 -1.25,0
DB9-STRIGHT = drill 1.016 pad 1.88 square: 1 -5.54,-1.42 | drill 1.016 pad 1.88: 2 -2.77,-1.42; 3 0,-1.42; 4 2.77,-1.42; 5 5.54,-1.42; 6 -4.15,1.42; 7 -1.38,1.42; 8 1.38,1.42; 9 4.15,1.42 | drill 3.302 pad 5.08: G1 -12.5,0; G2 12.5,0

### Placement (x,y rotation side)
C1  61.17,16.9 0 top
C2  50.3,27.29 270 top
C3  6.5,45.8 90 top
C4  12pF  [C0402']  22.4,42.5 180 top
C6  13.34,23.99 90 top
C7  13.34,26.79 270 top
C8  20.04,20.89 270 top
C9  22.44,20.99 270 top
C10  33.44,26.59 180 top
C11  12.14,29.39 180 top
C12  14.74,32.29 90 top
C13  14.94,20.79 90 top
C15  12pF  [C0402']  22.4,40.2 180 top
C18  13.29,20.36 90 top
C19  26.34,23.09 270 top
C22  52.7,24.96 270 top
C23  52.6,28.13 270 top
C25  49.1,30.74 90 top
C27  26.54,30.29 90 top
C28  37.14,26.59 0 top
C31  42.52,33.21 180 top
C35  56.8,29.25 0 top
C37  62.96,29.93 270 top
C38  49.1,27.28 270 top
C40  42.6,32.01 180 top
C48  46.96,39.98 270 top
C49  59.28,37.12 180 top
C50  58.2,34.53 270 top
C51  60.81,33.63 0 top
C52  59.33,39.47 180 top
C53  59.3,38.31 180 top
C54  49.1,43.73 270 top
C55  50.28,43.67 270 top
C56  55.74,33.37 0 top
C57  46.46,33.47 0 top
C58  54,28.15 90 top
C62  44.88,39.07 0 top
C77  23.3,48.9 0 top
C100  100nF  [C0805']  30.2,36.1 0 top
C102  100nF  [C0805']  24.3,36 0 top
C105  100nF  [C0805']  26.2,36 0 top
C106  100nF  [C0805']  29.2,44.6 180 top
C107  10uF  [C0805']  27.4,44.6 180 top
C108  100nF  [C0805']  28.2,36.1 180 top
CON_JTAG1  33.6,45.4 270 top
D1  23.94,17.44 270 top
D2  20.79,18.54 90 top
D3  11.19,16.69 270 top
D5  28.94,17.44 90 top
IC2  16.7,44.1 180 top
JP3  52.09,-0.3 90 top
JP5  1.7,42.1 270 top
K1  32.5,52.5 0 top
L1  9.5,38.7 180 top
L100  BLM18PG471SN1  [C0603']  25.8,44.5 180 top
POWER  49.31,22.7 270 top
Q1  9.8,35 90 top
R1  59.48,24.62 0 top
R2  59.58,26.66 0 top
R3  55.2,17.4 0 top
R4  42.47,35.66 0 top
R5  1.8,31.1 0 top
R6  1.8,32.5 0 top
R9  39.2,42.9 180 top
R10  42.52,34.46 0 top
R11  9,48.5 180 top
R12  45.22,30.61 90 top
R13  7.5,41.4 180 top
R14  7.5,42.7 180 top
R15  46.52,30.73 90 top
R16  50.31,30.76 90 top
R18  47.92,30.77 90 top
R19  44.9,40.27 0 top
R20  51.53,30.7 90 top
R21  42.51,38.09 0 top
R22  54.04,30.57 90 top
R24  43.61,41.49 0 top
R30  52,22.79 180 top
R37  6.7,32.9 270 top
R47  15.94,32.29 90 top
R48  12.2,31.8 90 top
SV1  4.9,24.3 270 top
SV2  4.9,11.5 90 top
TP1  11.7,48.8 0 top
TP2  14.8,35.4 0 top
TP3  57.5,14.3 0 top
TP4  16.09,30.49 90 top
TP10  9.2,44.4 0 top
TP13  45.3,23.3 0 top
U1  59.34,20.86 90 top
U3  60.1,30.2 90 top
U$1  9.4,31.2 0 top
U$2  37.2,41.2 270 top
U$3  18.84,26.39 90 top
U$4  10.8,25.6 270 top
U$5  53.2,34.6 0 bottom
U$6  46.8,35 0 bottom
U$7  34.74,22.79 90 top
U$8  51.93,38.32 0 top
U$9  29.24,22.79 90 top
U$10  29.24,30.69 270 top
U$11  35.54,30.69 270 top
U$13  54.1,15.7 0 bottom
U$15  43.4,16.1 0 bottom
U$19  24.1,41.3 90 top
X1  28.2,9.76 180 top

### Tracks (layer width: path | path; a pad name or v marks a point on that pad's centre or on a via)
!ADC_RESET
  Top 0.254: U$3.29 17.09,31.79 R47.2
+3V3  (via drill 0.3)
  Top 0.2: C53.2 58.65,38.37 58.63,38.39
  Top 0.254: IC2.17 17.45,49.85 17.4,49.9 | C105.1 25.05,38.1 18.2,38.1 17.45,38.85 IC2.44 17.45,40.55 16.65,41.35 IC2.36 10.25,41.35 v9.2,40.4 | 17.4,49.9 21.35,49.9 C77.1 22.35,48.75 23.5,47.6 25.7,47.6 | 35.74,32.45 U$11.1 | 25.7,47.6 31.14,47.6 CON_JTAG1.1 | L100.2 25.8,47.5 25.7,47.6 | 58.65,39.64 C52.2 | C52.2 | C54.2 50.22,43.08 C55.2 50.68,42.62 U$8.23 | U$8.12 57.27,38.07 57.5,38.3 C53.2 | U$8.14 56.57,39.07 57,39.5 58.65,39.5 C52.2 | 17.4,49.9 15.3,49.9 15.1,50.1 14.1,50.1 13.9,49.9 8.4,49.9 8.1,49.6 8.1,48.55 R11.2 8.05,47.05 v8.1,47 | R1.2 60.42,21.52 57.85,18.95 U1.8 | v1.2,33.6 1.15,33.55 R6.1 R5.1 | C1.1 57.15,16.9 56.15,17.9
  Top 0.305: R2.2 60.52,24.72 R1.2 | R16.1 50.31,29.61 v49.7,29 | 58.63,39.62 C52.2 | R3.2 56.15,17.9 56.15,18.82 U1.8
  Top 0.406: R2.2 60.52,28.18 v60.5,28.2 59.45,29.25 U3.5 C35.2 | R12.1 45.22,23.38 TP13.TP 45.9,22.7 v46.7,22.7 POWER.A | C105.1 28.1,36.95 C108.2 C100.1 35,37.05 | 35,37.05 37.25,37.05 40.15,39.95 R9.1 40.34,43.09 v47.6,43.09 v47.61,43.08 C54.2 | 35.74,32.45 35.74,36.31 35,37.05 | U$10.1 35,32.25 | 35,32.25 U$11.1 | U$9.1 U$7.1 39.43,21.23 v41,22.8 41,28.8 37.7,32.1 35.15,32.1 35,32.25 | 58.63,39.62 58.63,40.76 v58.6,40.79 | 58.63,38.39 58.63,39.42 C52.2
  Bottom 0.254: SV2.1 1.8,10.79 1.8,33 v1.2,33.6 1.3,33.7 4.4,33.7 5.7,32.4 6.9,32.4 10,35.5 10,39.5 9.2,40.3 v9.2,40.4 8.2,41.4 8.2,46.9 v8.1,47
  Bottom 0.406: v49.7,29 49.7,25.7 v46.7,22.7 46.6,22.8 v41,22.8 | v60.5,28.2 60.5,38.89 v58.6,40.79 56.3,43.09 v47.6,43.09
+5V  (via drill 0.3)
  Top 0.406: 62.92,29.24 C37.2 | C37.2 62.96,24.24 v63,24.2 | U$1.5 9.4,34.1 10.7,35.4 10.7,35.85 Q1.2 | U3.3 60.55,31.15 60.1,30.7 60.1,29.7 60.55,29.25 U3.1 62.93,29.25 C37.2 | Q1.2 8.55,35.95 v8.4,36.1 | Q1.2 10.85,35.95 12.7,34.1 13,34.1 v13.6,33.5 | v38.5,32.8 38.8,32.8 42.2,29.4 42.2,22.3 43.6,20.9 v53.3,20.9
  Bottom 0.406: v53.3,20.9 59.7,20.9 v63,24.2 | K1.4 K1.2 7.77,53.77 6.9,52.9 6.9,50.7 5.2,49 5.2,39.3 v8.4,36.1 | v38.5,32.8 38,32.3 14.8,32.3 v13.6,33.5 12.6,33.5 9.2,30.1 9.2,26.7 5.53,23.03 SV1.3
BP_RX  (via drill 0.3)
  Top 0.254: IC2.37 13.95,38.25 v13.2,37.5
  Bottom 0.254: v13.2,37.5 13.2,35.1 7.8,29.7 7.8,28.47 SV1.2
BP_TX  (via drill 0.3)
  Top 0.254: IC2.38 14.45,37.15 13.7,36.4 12.1,36.4 v12,36.3
  Bottom 0.254: SV1.1 4.9,29.3 6.3,30.7 7.8,30.7 11.8,34.7 11.8,36.1 v12,36.3
ECG_!DRDY  (via drill 0.3)
  Top 0.2: IC2.10 22.05,45.85 22.2,45.7 23.3,45.7 v24.1,46.5 | v48.6,46.5 50.6,46.5 51.18,45.92 U$8.22
  Bottom 0.2: v24.1,46.5 v48.6,46.5
ECG_CS  (via drill 0.3)
  Top 0.2: IC2.14 18.95,47.75 v19.9,46.8 | U$8.18 53.18,43.98 v54.3,45.1
  Bottom 0.2: v19.9,46.8 20.1,46.6 21.8,46.6 22.4,47.2 49.3,47.2 51.4,45.1 v54.3,45.1
ECG_MISO  (via drill 0.3)
  Top 0.2: IC2.13 20.43,48.38 v21.1,47.7 | U$8.21 51.68,45.98 v53.1,47.4
  Bottom 0.2: v21.1,47.7 21.4,48 52.5,48 v53.1,47.4
ECG_MOSI  (via drill 0.3)
  Top 0.2: U$8.19 52.68,44.58 v54.3,46.2
  Top 0.254: IC2.15 18.45,47.25 v18.8,46.9
  Bottom 0.2: v18.8,46.9 19.5,47.6 20.2,47.6 20.8,47 21.5,47 22.1,47.6 49.6,47.6 51,46.2 v54.3,46.2
ECG_PWDN  (via drill 0.3)
  Top 0.254: U$8.15 56.07,39.57 56.4,39.9 v56.4,40.1 | IC2.28 13.15,45.35 v13.9,44.6
  Bottom 0.254: v56.4,40.1 55.3,41.2 42.5,41.2 41.3,40 41.3,37.4 36.8,32.9 15.5,32.9 14,34.4 14,44.5 v13.9,44.6
ECG_SCK  (via drill 0.3)
  Top 0.2: U$8.20 52.18,45.28 v54.3,47.4
  Top 0.254: IC2.16 17.95,46.95 v17.8,46.8
  Bottom 0.2: 53.3,48.4 v54.3,47.4
  Bottom 0.254: 53.3,48.4 18.75,48.4 17.95,47.6 17.95,46.95 v17.8,46.8
ECG_START  (via drill 0.3)
  Top 0.254: U$8.16 55.03,40.43 55.9,41.3 v56.5,41.3 | IC2.27 13.85,45.85 v14,45.7
  Bottom 0.254: v56.5,41.3 56.1,41.7 42.2,41.7 40.7,40.2 40.7,37.7 36.4,33.4 15.8,33.4 14.7,34.5 14.7,45 v14,45.7
GND  (via drill 0.3)
  Top 0.152: 62.89,30.58 62.68,30.58 62.5,30.4
  Top 0.2: U$3.40 16.39,24.14 16.84,24.59
  Top 0.254: R18.1 46.56,30.12 R15.1 | 58.1,35.28 C50.1 | C37.1 62.89,30.58 | C49.1 59.93,37.03 | C50.1 58.2,35.3 | C11.2 11.49,30.14 R48.1 | U3.2 62.3,30.2 62.5,30.4 | IC2.5 22.05,43.35 C4.2 | U$8.10 56.31,37.07 C50.1 | C12.2 14.44,32.94 13.9,32.4
  Top 0.305: U$3.36 18.11,26.14 U$3.EXP@6 | U$3.13 21.09,25.14 21.04,25.19
  Bottom 0.305: U$3.EXP@10 U$3.EXP@11 U$3.EXP@7 U$3.EXP@6
  other vias: 60.3,45.09 56.9,27.69 20.4,15.09 50.6,39.69 63.2,48.99 51.4,26.09 46.2,28.69 36.2,40.49 44.6,33.59 55.7,35.69 61.9,43.59 51.9,38.29 48.6,35.39 57.5,40.29 57.5,32.19 62.1,32.29 46.4,44.79 41.99,15.16 21.24,21.49 19.44,2.59 13.54,2.64 13.2,39 17.9,42.8 27,41.2 16.5,37.8 32.6,34.6 60.3,42 37.7,36.1 44.4,44.3 44,24.9 29.9,49.6 24.9,50.3 21.4,40 11.4,45.6 14.6,49.4 47.24,5.89 47.24,6.89 47.24,7.89 47.24,8.89 47.24,9.89 47.24,10.89 47.24,11.89 54.34,43.99 55.34,43.99 57.34,43.39 56.34,43.99 58.14,42.59 58.94,41.79 54.4,26.39 55.1,29.59 55.1,30.59 55.1,31.69 54.1,32.39 52.7,31.29 47.74,14.29 47.74,15.29 47.74,16.29 47.74,17.29 26.1,18.8 26.1,19.8 26.1,20.8 24.2,26.4 21.5,16.7 23.1,19.4 24.7,13.8 28,15.7 28.7,14.9 29.5,14.1 30.2,13.3 25.6,6.5 24.3,6 22.8,6 21.5,6.1 20.7,7 50.24,9.89 50.24,10.89 50.24,13.49 58.84,12.49 52.74,12.79 55.84,4.29 54.94,5.29 54.04,6.19 53.14,7.09 52.24,7.99
  pour Bottom: 0,3 arc90 3,0 43,0 arc90 44,1 44,19 arc-90 45,20 arc-90 46,19 46,1 arc90 47,0 62,0 arc90 65,3 65,53 arc90 62,56 3,56 arc90 0,53
  pour Top: 0,3 arc90 3,0 43,0 arc90 44,1 44,19 arc-90 45,20 arc-90 46,19 46,1 arc90 47,0 62,0 arc90 65,3 65,53 arc90 62,56 3,56 arc90 0,53
INN  (via drill 0.3)
  Top 0.254: X1.5 20.12,11.18 16.14,15.16 v16.14,16.19 16.09,16.24 16.09,19.99 16.59,20.49 U$3.1 | v14.34,16.29 12.49,16.29 D3.1
  Bottom 0.254: v14.34,16.29 16.04,16.29 v16.14,16.19
INP  (via drill 0.3)
  Top 0.254: 17.49,16.34 v17.54,16.29 | D2.1 19.89,16.34 v19.84,16.29 | v17.54,16.29 17.54,15.06 20,12.6 23.5,12.6 24.1,12 24.1,8.39 X1.9 | U$3.2 17.09,16.74 v17.54,16.29
  Bottom 0.254: v17.54,16.29 v19.84,16.29
LED_ALM  (via drill 0.3)
  Top 0.254: U$3.22 20.59,31.29 21.5,32.2 v21.5,34.8 | IC2.20 15.95,46.75 v16.7,46
  Bottom 0.254: v21.5,34.8 21.3,35 16.4,35 15.7,35.7 15.7,45 v16.7,46
LED_DRV_SUP  (via drill 0.3)
  Top 0.254: U$3.17 27.66,27.14
  Top 0.305: U$3.18 U$3.17
  Top 0.406: C10.1 C28.1 36.19,28.48 U$11.2 32.53,29.13 30.5,27.1 v28.2,27.1 28.16,27.14 27.66,27.14 | D1.3 23.04,15.84 v22.8,15.6 | D5.3 28.11,18.09 v27.7,18.5
  Bottom 0.406: v28.2,27.1 27.7,26.6 v27.7,18.5 27.7,18.3 24.9,15.5 22.9,15.5 v22.8,15.6
N$1  (via drill 0.3)
  Top 0.254: v59.6,49.3 46.4,49.3 45.2,50.5 45.2,51.9 44.6,52.5 42.66,52.5 K1.28
  Top 0.305: R1.1 58.52,22.23 v58.5,22.2 57.8,21.5 U1.6
  Bottom 0.305: v58.5,22.2 58.6,22.2 63.9,27.5 63.9,45.9 60.5,49.3 v59.6,49.3
N$2  (via drill 0.3)
  Top 0.305: R2.1 58.56,26.6 57.4,26.6 56.1,25.3 v56.1,23.7 | v56.1,23.7 | v60.4,48.2 44.42,48.2 K1.27 | U1.5 56.01,23.61 v56.1,23.7
  Bottom 0.305: v56.1,23.7 57.7,23.7 63.3,29.3 63.3,45.5 60.6,48.2 v60.4,48.2
N$3
  Top 0.254: TP3.TP 56.2,14.3 54.24,16.25 R3.1
  Top 0.305: U1.7 55.02,20.23 54.2,19.4 54.2,17.44 R3.1
N$4
  Top 0.254: IC2.1 21.75,41.35 C15.2 23.45,40.7 U$19.P$2
N$6
  Top 0.254: IC2.6 25.65,43.85 L100.1 27.35,43.7 C107.1 C106.1
N$7
  Top 0.406: POWER.C 51.26,22.7 R30.2
N$8
  Top 0.254: 43.25,35.69 R4.2 44.26,35.66 45.67,37.07 U$8.31
N$9
  Top 0.254: U$3.38 13.84,25.14 C6.2 11.89,24.64 U$4.2
N$10  (via drill 0.3)
  Top 0.254: R4.1 40.87,35.66 v40.8,35.59 | C22.2 47.48,24.31 v46.2,25.59
  Bottom 0.254: v40.8,35.59 43.6,32.79 43.6,28.19 v46.2,25.59
N$11
  Top 0.254: C23.2 52.6,25.71 C22.1 52.28,25.19 48.01,25.19 47.1,26.1 47.1,27.7 48.9,29.5 48.9,29.89 C25.1
N$12
  Top 0.254: U$8.6 52.68,32.58 R22.2
N$13
  Top 0.254: U$3.37 13.84,25.64 C7.2 12.31,26.14 U$4.1
N$14
  Top 0.254: 51.5,31.38 R20.2 52.18,32 U$8.5
N$15
  Top 0.305: U$3.7 19.59,21.99 C8.1
N$16
  Top 0.254: TP4.P$1 16.59,29.99 U$3.30
N$19
  Top 0.254: U$8.27 47.22,39.07 C48.2
N$25
  Top 0.254: IC2.2 22.25,41.85 C4.1 23.55,42 U$19.P$1
N$26
  Top 0.254: R10.2 43.2,34.49 44.99,34.49 45.1,34.6 45.3,34.8 47.07,36.57 U$8.32
N$28
  Top 0.254: C31.2 R10.1
N$29  (via drill 0.3)
  Top 0.254: C40.1 43.25,32.59 | 43.25,32.59 43.25,33.13 C31.1 | v44.6,32.49 43.35,32.49 43.25,32.59 | C38.2 48.66,26.63 v47.9,27.39
  Bottom 0.254: v44.6,32.49 44.6,28.4 45.61,27.39 v47.9,27.39
N$30  (via drill 0.3)
  Top 0.254: C38.1 C2.1 51.53,29.17 R20.1
  Top 0.305: R20.1 52.65,30.05 v52.7,30.1 | JP3.TIP 55.54,12.96 v54.4,14.1
  Bottom 0.254: v52.7,30.1 53.6,29.2 53.6,23.1 52.3,21.8 52.3,16.2 v54.4,14.1
N$31
  Top 0.254: C40.2 42,31.96 42,31.49 42.4,31.09 44.8,31.09 45.17,31.46 R12.2 45.3,31.38 R15.2 48.14,33 50.3,33 51.18,33.88 U$8.3
N$32
  Top 0.2: R16.2
  Top 0.254: R18.2 49.07,31.42 C25.2 50.29,31.39 R16.2 50.4,31.5 50.4,32.4 51.68,33.68 U$8.4
N$33
  Top 0.2: 43.19,38.12 R21.2
  Top 0.254: U$8.29 43.18,38.07 R21.2
N$34
  Top 0.254: R19.2 45.53,40.35 C62.2 46.03,38.57 U$8.28
N$36
  Top 0.254: 58.6,37.09 C49.2 57.38,37.12 56.93,37.57 U$8.11
N$37
  Top 0.254: 56.3,33.46 C56.2 56.2,33.56 56.2,34.1 55.08,35.22 U$8.8
N$38
  Top 0.254: 55.07,33.39 C56.1 54.92,33.2 53.6,33.2 53.18,33.62 U$8.7
N$40
  Top 0.254: C51.1 59.91,33.88 C50.2 57.6,33.89 56.7,34.79 56.7,35.79 55.92,36.57 U$8.9
N$41
  Top 0.254: 47.23,33.59 C57.2 47.14,33.5 50.1,33.5 50.68,34.08 U$8.2
N$43
  Top 0.254: U$8.1 50.18,34.88 49.8,34.5 46.2,34.5 45.8,34.1 C57.1
N$45
  Top 0.254: C23.1 53.98,28.78 C58.2 54.04,28.84 R22.1
  Top 0.406: JP3.RING 48.64,16.94 50.4,18.7 52.6,18.7 54.2,20.3 54.2,25 55.6,26.4 55.6,28.1 54.9,28.8 C58.2
N$50
  Top 0.254: U$8.30 44.67,37.57 43.8,36.7 42.3,36.7 41.9,37.1 41.9,38.05 R21.1 | R24.2 44.25,41.58 R19.1 44.23,40.35 C62.1 42.18,39.07 41.9,38.79 41.9,38.13 R21.1 | R21.1
N$51  (via drill 0.3)
  Top 0.305: R24.1 42.96,40.26 v42.9,40.2 | JP3.SLEEVE 55.5,2.14 55.5,3.2 49.4,9.3 49.4,15.9 v49.6,16.1
  Bottom 0.254: v42.9,40.2 42.9,37.9 52.3,28.5 52.3,22.7 51.7,22.1
  Bottom 0.305: 51.7,22.1 51.7,18.2 v49.6,16.1
N$57
  Top 0.254: IC2.24 12.12,48.38 TP1.TP 11.4,48.5 R11.1
N$69
  Top 0.254: IC2.29 9.2,44.85 TP10.TP
N$72
  Top 0.406: U$1.3 U$1.2 U$1.1 8.45,30.2 R37.2
N$73
  Top 0.406: R48.2 12.15,32.5 U$1.4 10.8,32.95 Q1.1
N$80
  Top 0.406: U$1.6 8.45,34.65 Q1.3 8.7,35.1 8,35.1 7.55,35.55 L1.2
PD_ALM  (via drill 0.3)
  Top 0.254: U$3.23 20.09,33.79 v20.5,34.2 20.4,34.1 | IC2.19 16.45,47.55 v16.8,47.2
  Bottom 0.254: v20.5,34.2 16.1,34.2 15.2,35.1 15.2,45.6 v16.8,47.2
RPI_RXD  (via drill 0.3)
  Top 0.254: IC2.21 15.45,47.05 15,46.6 v15,46.5
  Bottom 0.254: K1.10 18.17,53.77 17.2,52.8 17.2,48.7 v15,46.5
RPI_TXD  (via drill 0.3)
  Top 0.254: IC2.22 14.95,47.65 14.2,46.9 v14,46.9
  Bottom 0.254: K1.8 15.77,53.77 14.7,52.7 14.7,50.6 15.5,49.8 15.5,48.4 v14,46.9
RX_ANA_SUP  (via drill 0.3)
  Top 0.254: U$3.39 14.84,24.64 14.64,24.44 v14.64,23.79 | U$3.33 14.66,27.64 13.94,28.36 v13.94,28.99 13.54,29.39 C11.1 | D2.3 21.69,19.71 v21.2,20.2 | v13.2,17.7 13.29,17.79 C18.1 13.18,19.3 10,19.3 9.2,18.5 9.2,16.3 9.46,16.04 D3.3
  Top 0.305: v32.64,23.99 35.47,23.99 U$7.2
  Bottom 0.254: 14.74,31.69 14.69,31.69 14,31 14,29.05 v13.94,28.99 14.64,28.29 v14.64,23.79 14.64,20.4 14.84,20.2 | v21.2,20.2 14.84,20.2 | v13.2,17.7 13.2,18.56 14.84,20.2
  Bottom 0.305: 14.74,31.69 28.64,31.69 32.64,27.69 v32.64,23.99
RX_DIG_SUP  (via drill 0.3)
  Top 0.2: R47.1 C12.1
  Top 0.305: U$9.2 29.22,24.04 C19.1 v26.34,25.49 | U$3.31 15.81,29.52 v14.94,30.39 14.74,30.59 C12.1
  Bottom 0.305: v14.94,30.39 25.54,30.39 26.34,29.59 v26.34,25.49
SAM_RESETN  (via drill 0.3)
  Top 0.254: R9.2 38.25,39.75 v37.4,38.9 | IC2.40 15.45,37.05 v16.8,35.7 16.5,35.4 TP2.TP
  Top 0.406: 37.9,43.25 R9.2 38.21,42.86 CON_JTAG1.10
  Bottom 0.254: v37.4,38.9 34,35.5 17,35.5 v16.8,35.7
SAM_SWDCLK
  Top 0.2: IC2.45 17.95,39.15 18.6,38.5 32.6,38.5 34.2,40.1 34.2,45.9 34.97,46.67 CON_JTAG1.4
SAM_SWDIO
  Top 0.2: IC2.46 18.45,39.25 18.8,38.9 32,38.9 33.6,40.5 33.6,46.7 34.84,47.94 CON_JTAG1.2
SPO2_CS  (via drill 0.3)
  Top 0.2: IC2.7 19.05,44.35 v18.6,43.9
  Top 0.254: U$3.27 18.09,36.49 v18.3,36.7
  Bottom 0.2: v18.6,43.9 18.6,37 v18.3,36.7
SPO2_DRDY  (via drill 0.3)
  Top 0.2: IC2.3 19.85,42.35 18.6,41.1 v17.9,41.1
  Top 0.254: U$3.28 17.59,36.21 v17.1,36.7
  Bottom 0.2: v17.9,41.1 17.9,37.5 v17.1,36.7
SPO2_MISO  (via drill 0.3)
  Top 0.2: IC2.9 19.85,45.35 v19.7,45.2
  Top 0.254: U$3.25 19.09,35.09 v20.7,36.7
  Bottom 0.2: v19.7,45.2 19.7,37.7 v20.7,36.7
SPO2_MOSI  (via drill 0.3)
  Top 0.2: IC2.11 20.45,46.35 20,45.9 19,45.9 18.6,45.5 v18.6,45
  Top 0.254: U$3.26 18.59,35.79 v19.5,36.7
  Bottom 0.2: v19.5,36.7 19.3,36.9 19.3,44.3 v18.6,45
SPO2_SCK  (via drill 0.3)
  Top 0.254: IC2.12 22.55,46.85 v22.9,46.5 | U$3.24 19.59,34.39 v21.9,36.7
  Bottom 0.2: v21.9,36.7 20.1,38.5 20.1,43.7 v22.9,46.5
SPO2_START  (via drill 0.3)
  Top 0.254: IC2.8 23.75,44.85 v24.4,45.5 | U$3.20 21.86,30.07 22.9,31.1 v22.9,36.7
  Bottom 0.254: v22.9,36.7 22.9,37 20.6,39.3 20.6,43 23.1,45.5 v24.4,45.5
TARGET_USB_N
  Top 0.254: IC2.33 8.3,42.85 R14.1
TARGET_USB_P
  Top 0.254: IC2.34 10.35,42.35 9.4,41.4 R13.1
TMP_SCL  (via drill 0.3)
  Top 0.254: IC2.26 10.85,46.35 10.4,45.9 v10.4,45.6 | R5.2 3.6,31.1 v3.7,31
  Bottom 0.254: v10.4,45.6 10.4,41.3 11.2,40.5 11.2,35 7.5,31.3 4,31.3 v3.7,31 2.8,30.1 2.8,18.8 4,17.6 6,17.6 7.2,16.4 7.2,12.53 SV2.2
TMP_SDA  (via drill 0.3)
  Top 0.254: IC2.25 10.25,46.85 9.4,46 v9.4,45.7 | R6.2 v3.7,32.5
  Bottom 0.254: v9.4,45.7 9.4,41.4 10.6,40.2 10.6,35.1 7.4,31.9 4.3,31.9 v3.7,32.5 2.3,31.1 2.3,15.37 SV2.3
TX_CTRL_SUP  (via drill 0.3)
  Top 0.254: C27.1 25.09,29.34 v25.04,29.29
  Top 0.305: U$3.11 22.44,23.57 v22.44,22.79 C9.1
  Top 0.406: C27.1 29.03,29.34 U$10.2
  Bottom 0.305: v25.04,29.29 25.04,25.39 v22.44,22.79
TXN
  Top 0.254: U$3.14 22.66,25.64 23.94,24.36 23.94,18.34 D1.1 24.96,17.44 26.4,16 26.4,14.8 28.2,13 X1.3
TXP
  Top 0.254: U$3.15 23.46,26.14 25.19,24.41 25.19,18.61 26.3,17.5 26.36,17.44 | X1.2 27.1,15.05 27.1,16.7 26.36,17.44 | D5.1 26.36,17.44
USB_N
  Top 0.254: JP5.2 R14.2
USB_P
  Top 0.254: JP5.3 5.65,42.05 6.3,41.4 R13.2
VCCIO  (via drill 0.3)
  Top 0.406: JP5.1 5.85,43.35 v6.5,44 C3.1 | L1.1 9.5,38.7 v9.2,39
  Bottom 0.406: v6.5,44 6.5,41.7 v9.2,39
VCM  (via drill 0.3)
  Top 0.2: U$3.4 18.09,21.69 17.8,21.4 17.8,17.3 18.3,16.8 18.3,15
  Top 0.254: v14.94,18.89 14.94,18.46 15.3,18.1 15.3,15.3 21.4,9.2 21.4,7.4 22,6.8 24.8,6.8 25.4,7.4 25.4,9.2 26.8,10.6 26.8,11.9 25.6,13.1 20.2,13.1 18.3,15
  Top 0.305: C13.1 v14.94,18.89
VDDCORE
  Top 0.254: IC2.43 16.95,38.55 17.9,37.6 23.65,37.6 C102.1

### Text on the board
tPlace: HealthyPi | JTAG | RST | BP/GLUCO | WP | ECG | TEMPERATURE | SpO2 Probe | v3
bPlace: protocentral.com | Get Started: http://proty.in/hpi | WARNING: When connected to body, / power only through an isolated source / or battery | HealthyPi | v3